# Altium schematic sheet FIT2017 Uno Shield.SchDoc
size A
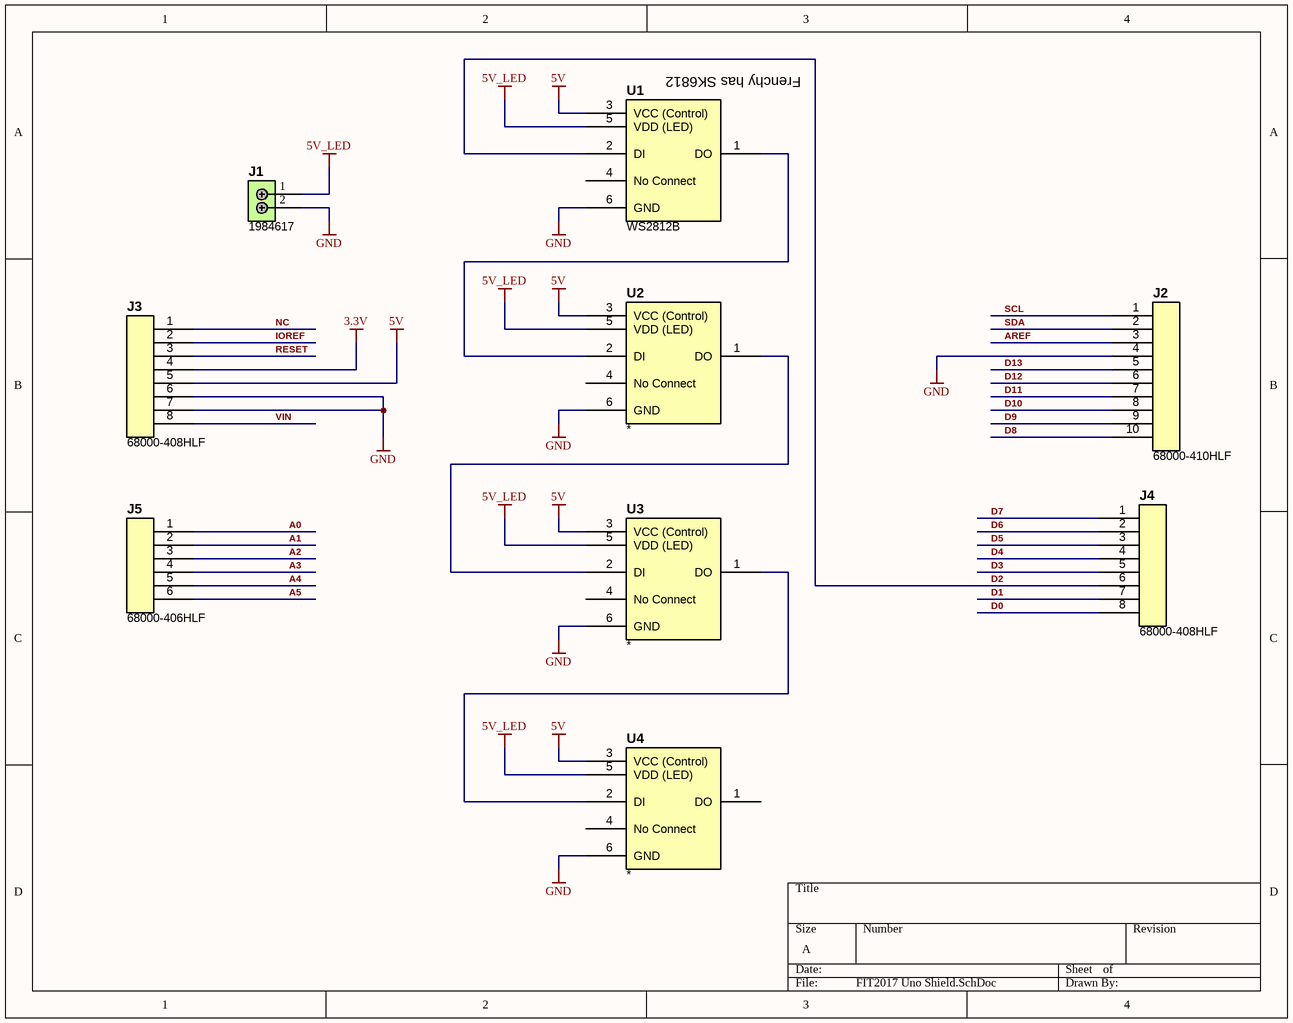
[diagram p0: FIT2017 Uno Shield.SchDoc]

## Parts
J1  1984617  [1984617]
J2  68000-410HLF  [68000-410HLF_Bottom Mount]
J3  68000-408HLF  [68000-408HLF_Bottom Mount]
J4  68000-408HLF  [68000-408HLF_Bottom Mount]
J5  68000-406HLF  [68000-406HLF_Bottom Mount]
U1  WS2812B  [WS2812]
U2  *  [WS2812]
U3  *  [WS2812]
U4  *  [WS2812]

## Nets
3.3V: J3.4
5V: J3.5 U1.3(VCC_(Control)) U2.3(VCC_(Control)) U3.3(VCC_(Control)) U4.3(VCC_(Control))
5V_LED: J1.1 U1.5(VDD_(LED)) U2.5(VDD_(LED)) U3.5(VDD_(LED)) U4.5(VDD_(LED))
GND: J1.2 J2.4 J3.6 J3.7 U1.6(GND) U2.6(GND) U3.6(GND) U4.6(GND)
A0: J5.1
A1: J5.2
A2: J5.3
A3: J5.4
A4: J5.5
A5: J5.6
AREF: J2.3
D0: J4.8
D1: J4.7
D2: J4.6 U1.2(DI)
D3: J4.5
D4: J4.4
D5: J4.3
D6: J4.2
D7: J4.1
D8: J2.10
D9: J2.9
D10: J2.8
D11: J2.7
D12: J2.6
D13: J2.5
IOREF: J3.2
NC: J3.1
RESET: J3.3
SCL: J2.1
SDA: J2.2
VIN: J3.8
NetU1_1: U1.1(DO) U2.2(DI)
NetU2_1: U2.1(DO) U3.2(DI)
NetU3_1: U3.1(DO) U4.2(DI)

Not connected (* = marked no-connect by the designer): U1 4(No_Connect); U2 4(No_Connect); U3 4(No_Connect); U4 1(DO) 4(No_Connect)

## Notes on the sheet
- (near U1) Frenchy has SK6812

## Library data of the parts
J1 = 1984617: CONN TERM BLOCK T/H 2POS 3.5MM; Manufacturer: Phoenix Contact; Number of Levels: 1; Positions Per Level: 2; Pitch: 0.138" (3.50mm); Mating Orientation: Horizontal with Board; Current: 10A; Voltage: 300V; Wire Gauge: 16-26 AWG; Wire Termination: Screw - Rising Cage Clamp; Torque - Screw: 0.22-0.25 Nm (1.9-2.2 Lb-In); Screw Thread: M2; Supplier 1: Digi-Key; Supplier Part Number 1: 277-1721-ND; Manufacturer Part Number: 1984617; RoHS: RoHS Compliant; Category: Connectors, Interconnects; Stock 1: 10915; Pricing 1: 1=0.34, 10=0.322, 50=0.308, 100=0.2996, 250=0.28, 500=0.2576, 1000=0.238 (USD); Mounting Type: Through Hole; Features: Interlocking (Side); Color: Green; Packaging: Bulk; Operating Temperature: -; Housing Material: Polyamide (PA), Nylon; Contact Material - Plating: -; Clamp Material - Plating: -; Screw Material - Plating: -; ComponentLink1URL: http://media.digikey.com/pdf/Data%20Sheets/Phoenix%20Contact%20PDFs/1984617.pdf; ComponentLink1Description: http://media.digikey.com/pdf/Data%20Sheets/Phoenix%20Contact%20PDFs/1984617.pdf; Value: 1984617
J2 = 68000-410HLF: 10 Positions Header, Unshrouded Connector 0.100" (2.54mm) Through Hole Tin; Manufacturer: Amphenol FCI; Current Rating: 3A; Voltage Rating: 1.5kV; Number of Positions: 10; Insulation Resistance: 5GR; Gender: Male; Connector Type: Male Pin; Mating Post Length: 5.84mm; Value: 68000-410HLF; Supplier 1: Avnet; Supplier Part Number 1: 68000-410HLF; Manufacturer Part Number: 68000-410HLF; Stock 1: 0; Pricing 1: 600=0.1616, 1200=0.1577, 2400=0.1542, 3600=0.1508, 6000=0.1489 (USD); Mount: Through Hole; Case/Package: 100; Contact Plating: Nickel,Tin; Contact Material: Bronze; Colour: Black; Housing Colour: Black; Housing Material: Thermoplastic; Min Operating Temperature: -65°C; Max Operating Temperature: 125°C; Number of Rows: 1; Contact Gender: Male; Packaging: Bulk; Package Quantity: 100; Termination: Solder; Number of Contacts: 10; Max Voltage Rating (AC): 1.5kV; Orientation: Straight; Length: 25.4mm; Pitch: 2.54mm; Termination Post Length: 2.41mm; Contact Mating Length: 0.23inch; Depth: 2.41mm; Flammability Rating: UL94 V-0; REACH SVHC: No SVHC; ComponentLink1URL: https://datasheet.ciiva.com/728/68000-728932.pdf; ComponentLink1Description: https://datasheet.ciiva.com/728/68000-728932.pdf; ComponentLink2URL: https://datasheet.ciiva.com/10140/68000-10140107.pdf; ComponentLink2Description: https://datasheet.ciiva.com/10140/68000-10140107.pdf
J3 J4 = 68000-408HLF: CONN HEADER 8POS .100 STR TIN; Manufacturer: Amphenol FCI; Pitch - Mating: 0.100" (2.54mm); Number of Positions: 8; Number of Positions Loaded: All; Style: Board to Board; Shrouding: Unshrouded; Contact Length - Mating: 0.230" (5.84mm); Contact Length - Post: 0.095" (2.41mm); Overall Contact Length: 0.425" (10.80mm); Material Flammability Rating: UL94 V-0; Value: 68000-408HLF; Supplier 1: Digi-Key; Supplier Part Number 1: 609-3264-ND; Manufacturer Part Number: 68000-408HLF; RoHS: RoHS Compliant; Category: Connectors, Interconnects; Stock 1: 4195; Pricing 1: 1=0.27, 10=0.256, 100=0.1789, 500=0.1533, 1000=0.12775, 5000=0.1095, 10000=0.1022 (USD); Packaging: Bulk; Part Status: Active; Connector Type: Header; Contact Type: Male Pin; Number of Rows: 1; Row Spacing - Mating: -; Mounting Type: Through Hole; Termination: Solder; Fastening Type: Push-Pull; Insulation Height: 0.100" (2.54mm); Contact Shape: Square; Contact Finish - Mating: Tin; Contact Finish Thickness - Mating: 100µin (2.54µm); Contact Finish - Post: Tin; Contact Material: Phosphor Bronze; Insulation Material: -; Features: -; Operating Temperature: -; Ingress Protection: -; Insulation Color: Black; Current Rating: -; Voltage Rating: -; Mated Stacking Heights: -; Contact Finish Thickness - Post: -; Applications: -; ComponentLink1URL: http://portal.fciconnect.com/Comergent//fci/drawing/68000.pdf; ComponentLink1Description: http://portal.fciconnect.com/Comergent//fci/drawing/68000.pdf
J5 = 68000-406HLF: CONN HEADER 6POS .100 STR TIN; Manufacturer: Amphenol FCI; Pitch - Mating: 0.100" (2.54mm); Number of Positions: 6; Number of Positions Loaded: All; Style: Board to Board; Shrouding: Unshrouded; Contact Length - Mating: 0.230" (5.84mm); Contact Length - Post: 0.095" (2.41mm); Overall Contact Length: 0.425" (10.80mm); Material Flammability Rating: UL94 V-0; Value: 68000-406HLF; Supplier 1: Digi-Key; Supplier Part Number 1: 609-3263-ND; Manufacturer Part Number: 68000-406HLF; RoHS: RoHS Compliant; Category: Connectors, Interconnects; Stock 1: 12972; Pricing 1: 1=0.25, 10=0.233, 100=0.1615, 500=0.13662, 1000=0.11178, 5000=0.09936, 10000=0.09005 (USD); Packaging: Bulk; Part Status: Active; Connector Type: Header; Contact Type: Male Pin; Number of Rows: 1; Row Spacing - Mating: -; Mounting Type: Through Hole; Termination: Solder; Fastening Type: Push-Pull; Insulation Height: 0.100" (2.54mm); Contact Shape: Square; Contact Finish - Mating: Tin; Contact Finish Thickness - Mating: 100µin (2.54µm); Contact Finish - Post: Tin; Contact Material: Phosphor Bronze; Insulation Material: -; Features: -; Operating Temperature: -; Ingress Protection: -; Insulation Color: Black; Current Rating: -; Voltage Rating: -; Mated Stacking Heights: -; Contact Finish Thickness - Post: -; Applications: -; ComponentLink1URL: http://portal.fciconnect.com/Comergent//fci/drawing/68000.pdf; ComponentLink1Description: http://portal.fciconnect.com/Comergent//fci/drawing/68000.pdf
U1-U4 = WS2812
  U1: Value: WS2812B
  U2-U4: Value: *